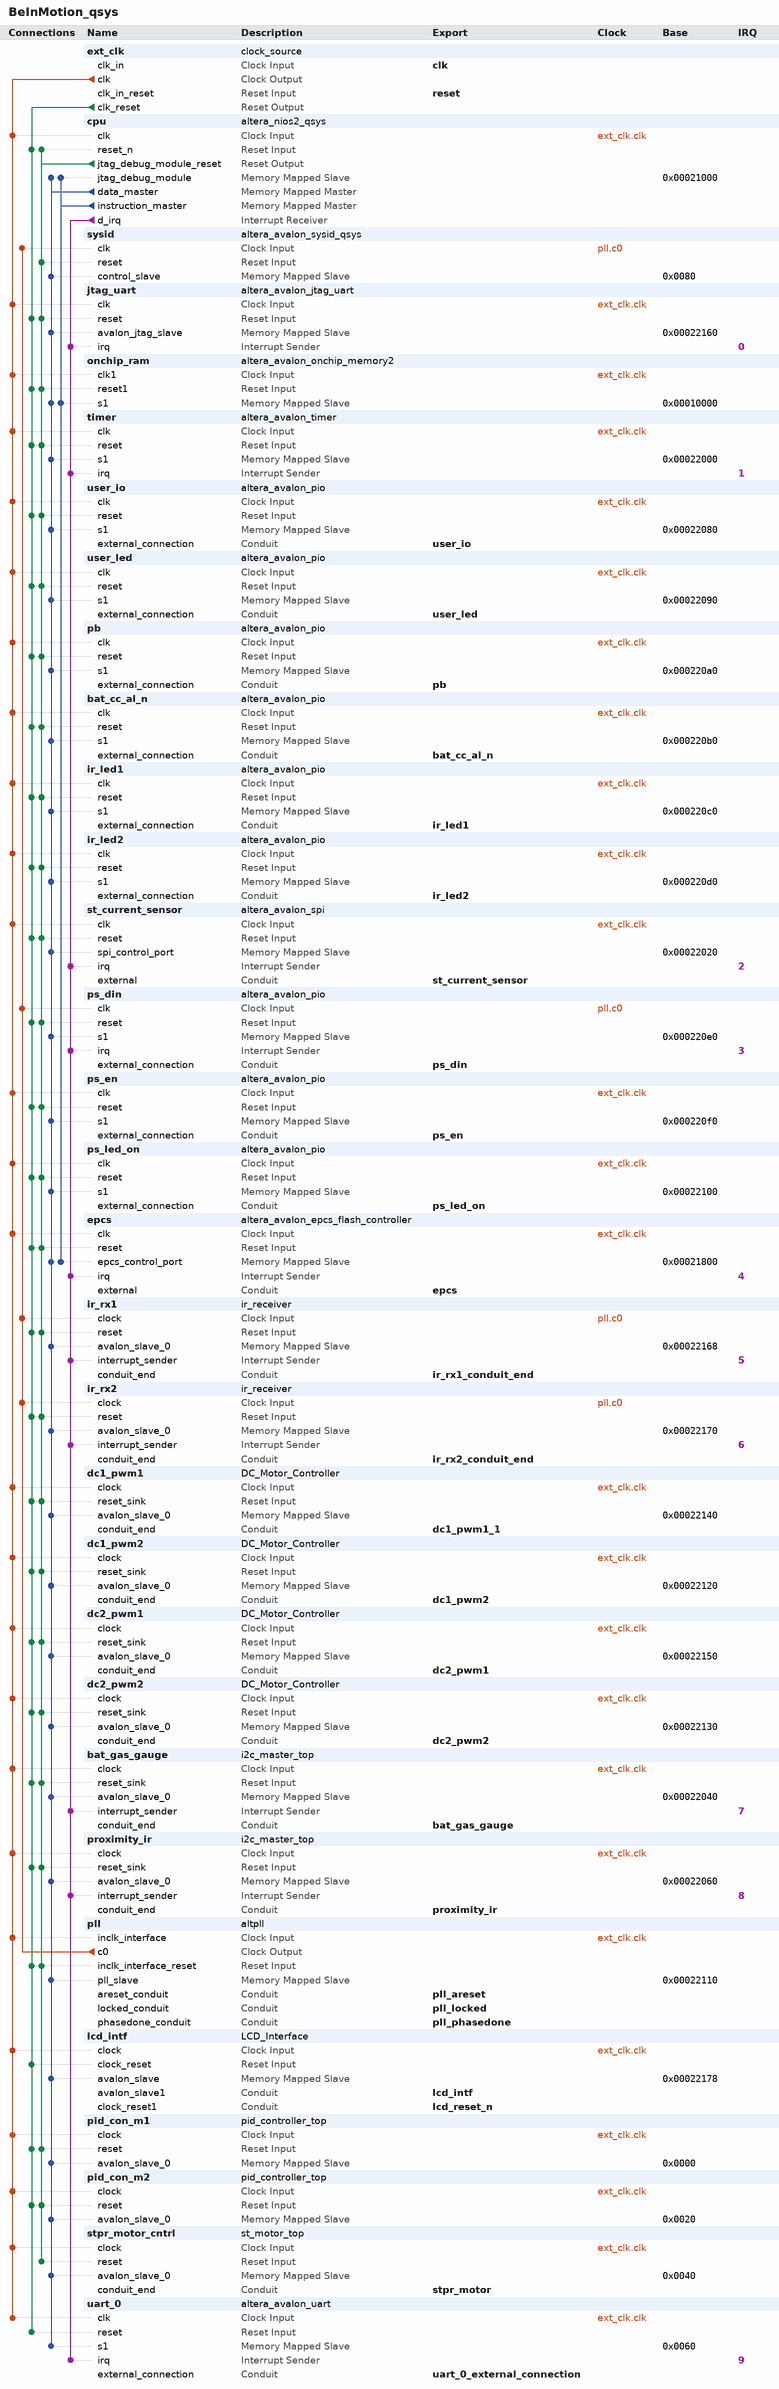
[diagram p0: system contents]
# Platform Designer (Qsys) system BeInMotion_qsys
# Parameters at their usual value, and those the tool derives, are not listed.
package require -exact qsys 11.1
create_system BeInMotion_qsys
set_project_property DEVICE_FAMILY CYCLONEIVE

add_instance ext_clk clock_source 11.1
set_instance_parameter_value ext_clk clockFrequency 50000000

add_instance cpu altera_nios2_qsys 11.1
set_instance_parameter_value cpu manuallyAssignCpuID false
set_instance_parameter_value cpu resetSlave epcs.epcs_control_port
set_instance_parameter_value cpu exceptionSlave onchip_ram.s1
set_instance_parameter_value cpu breakSlave cpu.jtag_debug_module
set_instance_parameter_value cpu impl Tiny
set_instance_parameter_value cpu icache_size 4096

add_instance sysid altera_avalon_sysid_qsys 11.1
set_instance_parameter_value sysid id 0

add_instance jtag_uart altera_avalon_jtag_uart 11.1
set_instance_parameter_value jtag_uart simInteractiveOptions INTERACTIVE_ASCII_OUTPUT

add_instance onchip_ram altera_avalon_onchip_memory2 11.1
set_instance_parameter_value onchip_ram dataWidth 32
set_instance_parameter_value onchip_ram dualPort false
set_instance_parameter_value onchip_ram initMemContent true
set_instance_parameter_value onchip_ram initializationFileName onchip_ram
set_instance_parameter_value onchip_ram memorySize 40000

add_instance timer altera_avalon_timer 11.1
set_instance_parameter_value timer period 1
set_instance_parameter_value timer periodUnits MSEC
set_instance_parameter_value timer timerPreset CUSTOM

add_instance user_io altera_avalon_pio 11.1
set_instance_parameter_value user_io direction Bidir
set_instance_parameter_value user_io width 8

add_instance user_led altera_avalon_pio 11.1
set_instance_parameter_value user_led direction Output
set_instance_parameter_value user_led width 3

add_instance pb altera_avalon_pio 11.1
set_instance_parameter_value pb direction Input
set_instance_parameter_value pb width 7

add_instance bat_cc_al_n altera_avalon_pio 11.1
set_instance_parameter_value bat_cc_al_n direction Bidir
set_instance_parameter_value bat_cc_al_n width 1

add_instance ir_led1 altera_avalon_pio 11.1
set_instance_parameter_value ir_led1 direction Output
set_instance_parameter_value ir_led1 width 1

add_instance ir_led2 altera_avalon_pio 11.1
set_instance_parameter_value ir_led2 direction Output
set_instance_parameter_value ir_led2 width 1

add_instance st_current_sensor altera_avalon_spi 11.1
set_instance_parameter_value st_current_sensor clockPolarity 0
set_instance_parameter_value st_current_sensor dataWidth 16
set_instance_parameter_value st_current_sensor masterSPI true
set_instance_parameter_value st_current_sensor numberOfSlaves 1
set_instance_parameter_value st_current_sensor targetClockRate 1000000

add_instance ps_din altera_avalon_pio 11.1
set_instance_parameter_value ps_din captureEdge true
set_instance_parameter_value ps_din direction Input
set_instance_parameter_value ps_din edgeType ANY
set_instance_parameter_value ps_din generateIRQ true
set_instance_parameter_value ps_din irqType EDGE
set_instance_parameter_value ps_din width 1

add_instance ps_en altera_avalon_pio 11.1
set_instance_parameter_value ps_en direction Output
set_instance_parameter_value ps_en width 1

add_instance ps_led_on altera_avalon_pio 11.1
set_instance_parameter_value ps_led_on direction Output
set_instance_parameter_value ps_led_on width 1

add_instance epcs altera_avalon_epcs_flash_controller 11.1

add_instance ir_rx1 ir_receiver 1.0

add_instance ir_rx2 ir_receiver 1.0

add_instance dc1_pwm1 DC_Motor_Controller 1.0
set_instance_parameter_value dc1_pwm1 clock_divide_reg_init 0
set_instance_parameter_value dc1_pwm1 duty_cycle_reg_init 0

add_instance dc1_pwm2 DC_Motor_Controller 1.0
set_instance_parameter_value dc1_pwm2 clock_divide_reg_init 0
set_instance_parameter_value dc1_pwm2 duty_cycle_reg_init 0

add_instance dc2_pwm1 DC_Motor_Controller 1.0
set_instance_parameter_value dc2_pwm1 clock_divide_reg_init 0
set_instance_parameter_value dc2_pwm1 duty_cycle_reg_init 0

add_instance dc2_pwm2 DC_Motor_Controller 1.0
set_instance_parameter_value dc2_pwm2 clock_divide_reg_init 0
set_instance_parameter_value dc2_pwm2 duty_cycle_reg_init 0

add_instance bat_gas_gauge i2c_master_top 1.0

add_instance proximity_ir i2c_master_top 1.0

add_instance pll altpll 11.1
set_instance_parameter_value pll INCLK0_INPUT_FREQUENCY 20000
set_instance_parameter_value pll CLK0_MULTIPLY_BY 1
set_instance_parameter_value pll CLK1_MULTIPLY_BY 2
set_instance_parameter_value pll CLK0_DIVIDE_BY 50
set_instance_parameter_value pll CLK1_DIVIDE_BY 1
set_instance_parameter_value pll CLK1_PHASE_SHIFT 0
set_instance_parameter_value pll CLK1_DUTY_CYCLE 50
set_instance_parameter_value pll PORT_clk1 PORT_USED
set_instance_parameter_value pll PORT_clk2 PORT_UNUSED
set_instance_parameter_value pll PORT_clk3 PORT_UNUSED
set_instance_parameter_value pll PORT_ARESET PORT_UNUSED
set_instance_parameter_value pll PORT_LOCKED PORT_UNUSED

add_instance lcd_intf LCD_Interface 8.0

add_instance pid_con_m1 pid_controller_top 1.0
set_instance_parameter_value pid_con_m1 Max 65535
set_instance_parameter_value pid_con_m1 Min 0

add_instance pid_con_m2 pid_controller_top 1.0
set_instance_parameter_value pid_con_m2 Max 65535
set_instance_parameter_value pid_con_m2 Min 0

add_instance stpr_motor_cntrl st_motor_top 1.0
set_instance_parameter_value stpr_motor_cntrl IDLE 0
set_instance_parameter_value stpr_motor_cntrl WAVE 1
set_instance_parameter_value stpr_motor_cntrl HALF 2
set_instance_parameter_value stpr_motor_cntrl FULL 3
set_instance_parameter_value stpr_motor_cntrl MICRO 4
set_instance_parameter_value stpr_motor_cntrl WAVE_MODE1 0
set_instance_parameter_value stpr_motor_cntrl WAVE_MODE2 1
set_instance_parameter_value stpr_motor_cntrl WAVE_MODE3 2
set_instance_parameter_value stpr_motor_cntrl WAVE_MODE4 3
set_instance_parameter_value stpr_motor_cntrl FULL_MODE1 0
set_instance_parameter_value stpr_motor_cntrl FULL_MODE2 1
set_instance_parameter_value stpr_motor_cntrl FULL_MODE3 2
set_instance_parameter_value stpr_motor_cntrl FULL_MODE4 3
set_instance_parameter_value stpr_motor_cntrl HALF_MODE1 0
set_instance_parameter_value stpr_motor_cntrl HALF_MODE2 1
set_instance_parameter_value stpr_motor_cntrl HALF_MODE3 2
set_instance_parameter_value stpr_motor_cntrl HALF_MODE4 3
set_instance_parameter_value stpr_motor_cntrl HALF_MODE5 4
set_instance_parameter_value stpr_motor_cntrl HALF_MODE6 5
set_instance_parameter_value stpr_motor_cntrl HALF_MODE7 6
set_instance_parameter_value stpr_motor_cntrl HALF_MODE8 7
set_instance_parameter_value stpr_motor_cntrl MICRO_MODE1 0
set_instance_parameter_value stpr_motor_cntrl MICRO_MODE2 1
set_instance_parameter_value stpr_motor_cntrl MICRO_MODE3 2
set_instance_parameter_value stpr_motor_cntrl MICRO_MODE4 3

add_instance uart_0 altera_avalon_uart 11.1
set_instance_parameter_value uart_0 baud 9600
set_instance_parameter_value uart_0 dataBits 8
set_instance_parameter_value uart_0 fixedBaud true
set_instance_parameter_value uart_0 parity NONE
set_instance_parameter_value uart_0 stopBits 1
set_instance_parameter_value uart_0 useCtsRts true

# connections
add_connection ext_clk.clk bat_cc_al_n.clk clock
add_connection ext_clk.clk bat_gas_gauge.clock clock
add_connection ext_clk.clk cpu.clk clock
add_connection ext_clk.clk dc1_pwm1.clock clock
add_connection ext_clk.clk dc1_pwm2.clock clock
add_connection ext_clk.clk dc2_pwm1.clock clock
add_connection ext_clk.clk dc2_pwm2.clock clock
add_connection ext_clk.clk epcs.clk clock
add_connection ext_clk.clk ir_led1.clk clock
add_connection ext_clk.clk ir_led2.clk clock
add_connection ext_clk.clk jtag_uart.clk clock
add_connection ext_clk.clk lcd_intf.clock clock
add_connection ext_clk.clk onchip_ram.clk1 clock
add_connection ext_clk.clk pb.clk clock
add_connection ext_clk.clk pid_con_m1.clock clock
add_connection ext_clk.clk pid_con_m2.clock clock
add_connection ext_clk.clk pll.inclk_interface clock
add_connection ext_clk.clk proximity_ir.clock clock
add_connection ext_clk.clk ps_en.clk clock
add_connection ext_clk.clk ps_led_on.clk clock
add_connection ext_clk.clk st_current_sensor.clk clock
add_connection ext_clk.clk stpr_motor_cntrl.clock clock
add_connection ext_clk.clk timer.clk clock
add_connection ext_clk.clk uart_0.clk clock
add_connection ext_clk.clk user_io.clk clock
add_connection ext_clk.clk user_led.clk clock
add_connection pll.c0 ir_rx1.clock clock
add_connection pll.c0 ir_rx2.clock clock
add_connection pll.c0 ps_din.clk clock
add_connection pll.c0 sysid.clk clock
add_connection cpu.jtag_debug_module_reset bat_cc_al_n.reset reset
add_connection cpu.jtag_debug_module_reset bat_gas_gauge.reset_sink reset
add_connection cpu.jtag_debug_module_reset cpu.reset_n reset
add_connection cpu.jtag_debug_module_reset dc1_pwm1.reset_sink reset
add_connection cpu.jtag_debug_module_reset dc1_pwm2.reset_sink reset
add_connection cpu.jtag_debug_module_reset dc2_pwm1.reset_sink reset
add_connection cpu.jtag_debug_module_reset dc2_pwm2.reset_sink reset
add_connection cpu.jtag_debug_module_reset epcs.reset reset
add_connection cpu.jtag_debug_module_reset ir_led1.reset reset
add_connection cpu.jtag_debug_module_reset ir_led2.reset reset
add_connection cpu.jtag_debug_module_reset ir_rx1.reset reset
add_connection cpu.jtag_debug_module_reset ir_rx2.reset reset
add_connection cpu.jtag_debug_module_reset jtag_uart.reset reset
add_connection cpu.jtag_debug_module_reset onchip_ram.reset1 reset
add_connection cpu.jtag_debug_module_reset pb.reset reset
add_connection cpu.jtag_debug_module_reset pid_con_m1.reset reset
add_connection cpu.jtag_debug_module_reset pid_con_m2.reset reset
add_connection cpu.jtag_debug_module_reset pll.inclk_interface_reset reset
add_connection cpu.jtag_debug_module_reset proximity_ir.reset_sink reset
add_connection cpu.jtag_debug_module_reset ps_din.reset reset
add_connection cpu.jtag_debug_module_reset ps_en.reset reset
add_connection cpu.jtag_debug_module_reset ps_led_on.reset reset
add_connection cpu.jtag_debug_module_reset st_current_sensor.reset reset
add_connection cpu.jtag_debug_module_reset stpr_motor_cntrl.reset reset
add_connection cpu.jtag_debug_module_reset sysid.reset reset
add_connection cpu.jtag_debug_module_reset timer.reset reset
add_connection cpu.jtag_debug_module_reset user_io.reset reset
add_connection cpu.jtag_debug_module_reset user_led.reset reset
add_connection ext_clk.clk_reset bat_cc_al_n.reset reset
add_connection ext_clk.clk_reset bat_gas_gauge.reset_sink reset
add_connection ext_clk.clk_reset cpu.reset_n reset
add_connection ext_clk.clk_reset dc1_pwm1.reset_sink reset
add_connection ext_clk.clk_reset dc1_pwm2.reset_sink reset
add_connection ext_clk.clk_reset dc2_pwm1.reset_sink reset
add_connection ext_clk.clk_reset dc2_pwm2.reset_sink reset
add_connection ext_clk.clk_reset epcs.reset reset
add_connection ext_clk.clk_reset ir_led1.reset reset
add_connection ext_clk.clk_reset ir_led2.reset reset
add_connection ext_clk.clk_reset ir_rx1.reset reset
add_connection ext_clk.clk_reset ir_rx2.reset reset
add_connection ext_clk.clk_reset jtag_uart.reset reset
add_connection ext_clk.clk_reset lcd_intf.clock_reset reset
add_connection ext_clk.clk_reset onchip_ram.reset1 reset
add_connection ext_clk.clk_reset pb.reset reset
add_connection ext_clk.clk_reset pid_con_m1.reset reset
add_connection ext_clk.clk_reset pid_con_m2.reset reset
add_connection ext_clk.clk_reset pll.inclk_interface_reset reset
add_connection ext_clk.clk_reset proximity_ir.reset_sink reset
add_connection ext_clk.clk_reset ps_din.reset reset
add_connection ext_clk.clk_reset ps_en.reset reset
add_connection ext_clk.clk_reset ps_led_on.reset reset
add_connection ext_clk.clk_reset st_current_sensor.reset reset
add_connection ext_clk.clk_reset timer.reset reset
add_connection ext_clk.clk_reset uart_0.reset reset
add_connection ext_clk.clk_reset user_io.reset reset
add_connection ext_clk.clk_reset user_led.reset reset
add_connection cpu.data_master bat_cc_al_n.s1 avalon
set_connection_parameter_value cpu.data_master/bat_cc_al_n.s1 baseAddress 0x000220b0
add_connection cpu.data_master bat_gas_gauge.avalon_slave_0 avalon
set_connection_parameter_value cpu.data_master/bat_gas_gauge.avalon_slave_0 baseAddress 0x00022040
add_connection cpu.data_master cpu.jtag_debug_module avalon
set_connection_parameter_value cpu.data_master/cpu.jtag_debug_module baseAddress 0x00021000
add_connection cpu.data_master dc1_pwm1.avalon_slave_0 avalon
set_connection_parameter_value cpu.data_master/dc1_pwm1.avalon_slave_0 baseAddress 0x00022140
add_connection cpu.data_master dc1_pwm2.avalon_slave_0 avalon
set_connection_parameter_value cpu.data_master/dc1_pwm2.avalon_slave_0 baseAddress 0x00022120
add_connection cpu.data_master dc2_pwm1.avalon_slave_0 avalon
set_connection_parameter_value cpu.data_master/dc2_pwm1.avalon_slave_0 baseAddress 0x00022150
add_connection cpu.data_master dc2_pwm2.avalon_slave_0 avalon
set_connection_parameter_value cpu.data_master/dc2_pwm2.avalon_slave_0 baseAddress 0x00022130
add_connection cpu.data_master epcs.epcs_control_port avalon
set_connection_parameter_value cpu.data_master/epcs.epcs_control_port baseAddress 0x00021800
add_connection cpu.data_master ir_led1.s1 avalon
set_connection_parameter_value cpu.data_master/ir_led1.s1 baseAddress 0x000220c0
add_connection cpu.data_master ir_led2.s1 avalon
set_connection_parameter_value cpu.data_master/ir_led2.s1 baseAddress 0x000220d0
add_connection cpu.data_master ir_rx1.avalon_slave_0 avalon
set_connection_parameter_value cpu.data_master/ir_rx1.avalon_slave_0 baseAddress 0x00022168
add_connection cpu.data_master ir_rx2.avalon_slave_0 avalon
set_connection_parameter_value cpu.data_master/ir_rx2.avalon_slave_0 baseAddress 0x00022170
add_connection cpu.data_master jtag_uart.avalon_jtag_slave avalon
set_connection_parameter_value cpu.data_master/jtag_uart.avalon_jtag_slave baseAddress 0x00022160
add_connection cpu.data_master lcd_intf.avalon_slave avalon
set_connection_parameter_value cpu.data_master/lcd_intf.avalon_slave baseAddress 0x00022178
add_connection cpu.data_master onchip_ram.s1 avalon
set_connection_parameter_value cpu.data_master/onchip_ram.s1 baseAddress 0x00010000
add_connection cpu.data_master pb.s1 avalon
set_connection_parameter_value cpu.data_master/pb.s1 baseAddress 0x000220a0
add_connection cpu.data_master pid_con_m1.avalon_slave_0 avalon
set_connection_parameter_value cpu.data_master/pid_con_m1.avalon_slave_0 baseAddress 0x0000
add_connection cpu.data_master pid_con_m2.avalon_slave_0 avalon
set_connection_parameter_value cpu.data_master/pid_con_m2.avalon_slave_0 baseAddress 0x0020
add_connection cpu.data_master pll.pll_slave avalon
set_connection_parameter_value cpu.data_master/pll.pll_slave baseAddress 0x00022110
add_connection cpu.data_master proximity_ir.avalon_slave_0 avalon
set_connection_parameter_value cpu.data_master/proximity_ir.avalon_slave_0 baseAddress 0x00022060
add_connection cpu.data_master ps_din.s1 avalon
set_connection_parameter_value cpu.data_master/ps_din.s1 baseAddress 0x000220e0
add_connection cpu.data_master ps_en.s1 avalon
set_connection_parameter_value cpu.data_master/ps_en.s1 baseAddress 0x000220f0
add_connection cpu.data_master ps_led_on.s1 avalon
set_connection_parameter_value cpu.data_master/ps_led_on.s1 baseAddress 0x00022100
add_connection cpu.data_master st_current_sensor.spi_control_port avalon
set_connection_parameter_value cpu.data_master/st_current_sensor.spi_control_port baseAddress 0x00022020
add_connection cpu.data_master stpr_motor_cntrl.avalon_slave_0 avalon
set_connection_parameter_value cpu.data_master/stpr_motor_cntrl.avalon_slave_0 baseAddress 0x0040
add_connection cpu.data_master sysid.control_slave avalon
set_connection_parameter_value cpu.data_master/sysid.control_slave baseAddress 0x0080
add_connection cpu.data_master timer.s1 avalon
set_connection_parameter_value cpu.data_master/timer.s1 baseAddress 0x00022000
add_connection cpu.data_master uart_0.s1 avalon
set_connection_parameter_value cpu.data_master/uart_0.s1 baseAddress 0x0060
add_connection cpu.data_master user_io.s1 avalon
set_connection_parameter_value cpu.data_master/user_io.s1 baseAddress 0x00022080
add_connection cpu.data_master user_led.s1 avalon
set_connection_parameter_value cpu.data_master/user_led.s1 baseAddress 0x00022090
add_connection cpu.instruction_master cpu.jtag_debug_module avalon
set_connection_parameter_value cpu.instruction_master/cpu.jtag_debug_module baseAddress 0x00021000
add_connection cpu.instruction_master epcs.epcs_control_port avalon
set_connection_parameter_value cpu.instruction_master/epcs.epcs_control_port baseAddress 0x00021800
add_connection cpu.instruction_master onchip_ram.s1 avalon
set_connection_parameter_value cpu.instruction_master/onchip_ram.s1 baseAddress 0x00010000
add_connection cpu.d_irq bat_gas_gauge.interrupt_sender interrupt
set_connection_parameter_value cpu.d_irq/bat_gas_gauge.interrupt_sender irqNumber 7
add_connection cpu.d_irq epcs.irq interrupt
set_connection_parameter_value cpu.d_irq/epcs.irq irqNumber 4
add_connection cpu.d_irq ir_rx1.interrupt_sender interrupt
set_connection_parameter_value cpu.d_irq/ir_rx1.interrupt_sender irqNumber 5
add_connection cpu.d_irq ir_rx2.interrupt_sender interrupt
set_connection_parameter_value cpu.d_irq/ir_rx2.interrupt_sender irqNumber 6
add_connection cpu.d_irq jtag_uart.irq interrupt
set_connection_parameter_value cpu.d_irq/jtag_uart.irq irqNumber 0
add_connection cpu.d_irq proximity_ir.interrupt_sender interrupt
set_connection_parameter_value cpu.d_irq/proximity_ir.interrupt_sender irqNumber 8
add_connection cpu.d_irq ps_din.irq interrupt
set_connection_parameter_value cpu.d_irq/ps_din.irq irqNumber 3
add_connection cpu.d_irq st_current_sensor.irq interrupt
set_connection_parameter_value cpu.d_irq/st_current_sensor.irq irqNumber 2
add_connection cpu.d_irq timer.irq interrupt
set_connection_parameter_value cpu.d_irq/timer.irq irqNumber 1
add_connection cpu.d_irq uart_0.irq interrupt
set_connection_parameter_value cpu.d_irq/uart_0.irq irqNumber 9

# exported interfaces
add_interface clk clock sink
set_interface_property clk EXPORT_OF ext_clk.clk_in
add_interface reset reset sink
set_interface_property reset EXPORT_OF ext_clk.clk_in_reset
add_interface user_io conduit end
set_interface_property user_io EXPORT_OF user_io.external_connection
add_interface pb conduit end
set_interface_property pb EXPORT_OF pb.external_connection
add_interface user_led conduit end
set_interface_property user_led EXPORT_OF user_led.external_connection
add_interface bat_cc_al_n conduit end
set_interface_property bat_cc_al_n EXPORT_OF bat_cc_al_n.external_connection
add_interface ir_led1 conduit end
set_interface_property ir_led1 EXPORT_OF ir_led1.external_connection
add_interface ir_led2 conduit end
set_interface_property ir_led2 EXPORT_OF ir_led2.external_connection
add_interface st_current_sensor conduit end
set_interface_property st_current_sensor EXPORT_OF st_current_sensor.external
add_interface ps_din conduit end
set_interface_property ps_din EXPORT_OF ps_din.external_connection
add_interface ps_en conduit end
set_interface_property ps_en EXPORT_OF ps_en.external_connection
add_interface ps_led_on conduit end
set_interface_property ps_led_on EXPORT_OF ps_led_on.external_connection
add_interface epcs conduit end
set_interface_property epcs EXPORT_OF epcs.external
add_interface pll_locked conduit end
set_interface_property pll_locked EXPORT_OF pll.locked_conduit
add_interface pll_areset conduit end
set_interface_property pll_areset EXPORT_OF pll.areset_conduit
add_interface pll_phasedone conduit end
set_interface_property pll_phasedone EXPORT_OF pll.phasedone_conduit
add_interface ir_rx1_conduit_end conduit end
set_interface_property ir_rx1_conduit_end EXPORT_OF ir_rx1.conduit_end
add_interface ir_rx2_conduit_end conduit end
set_interface_property ir_rx2_conduit_end EXPORT_OF ir_rx2.conduit_end
add_interface dc1_pwm2 conduit end
set_interface_property dc1_pwm2 EXPORT_OF dc1_pwm2.conduit_end
add_interface dc2_pwm1 conduit end
set_interface_property dc2_pwm1 EXPORT_OF dc2_pwm1.conduit_end
add_interface dc2_pwm2 conduit end
set_interface_property dc2_pwm2 EXPORT_OF dc2_pwm2.conduit_end
add_interface dc1_pwm1_1 conduit end
set_interface_property dc1_pwm1_1 EXPORT_OF dc1_pwm1.conduit_end
add_interface bat_gas_gauge conduit end
set_interface_property bat_gas_gauge EXPORT_OF bat_gas_gauge.conduit_end
add_interface proximity_ir conduit end
set_interface_property proximity_ir EXPORT_OF proximity_ir.conduit_end
add_interface lcd_reset_n conduit end
set_interface_property lcd_reset_n EXPORT_OF lcd_intf.clock_reset1
add_interface lcd_intf conduit end
set_interface_property lcd_intf EXPORT_OF lcd_intf.avalon_slave1
add_interface stpr_motor conduit end
set_interface_property stpr_motor EXPORT_OF stpr_motor_cntrl.conduit_end
add_interface uart_0_external_connection conduit end
set_interface_property uart_0_external_connection EXPORT_OF uart_0.external_connection

save_system BeInMotion_qsys.qsys
